# EAGLE schematic anemo2 (EAGLE 6.4)
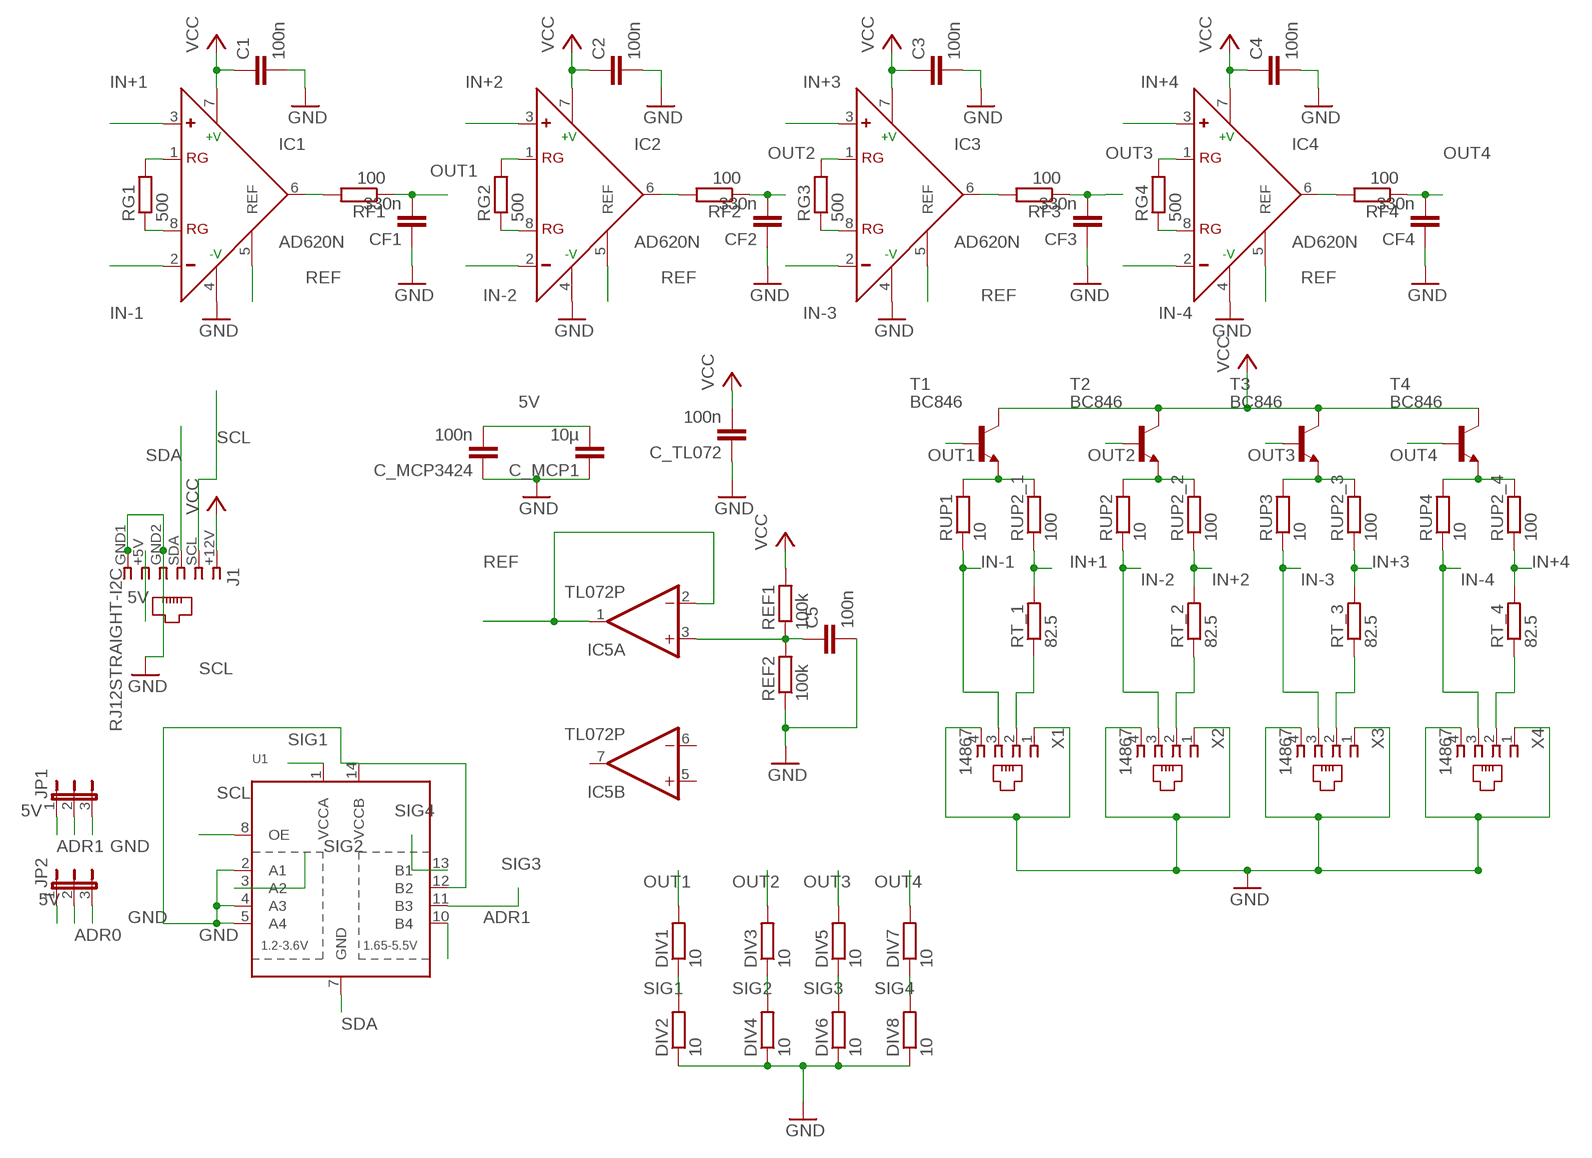
[diagram p0: schematic, sheet 1]

## Parts
C1  100n  C-EUC1206  [C1206]
C2  100n  C-EUC1206  [C1206]
C3  100n  C-EUC1206  [C1206]
C4  100n  C-EUC1206  [C1206]
C5  100n  C-EUC1206  [C1206]
C_MCP1  10µ  C-EUC1206  [C1206]
C_MCP3424  100n  C-EUC1206  [C1206]
C_TL072  100n  C-EUC1206  [C1206]
CF1  330n  C-EUC1206  [C1206]
CF2  330n  C-EUC1206  [C1206]
CF3  330n  C-EUC1206  [C1206]
CF4  330n  C-EUC1206  [C1206]
DIV1  10  R-EU_M1206  [M1206]
DIV2  10  R-EU_M1206  [M1206]
DIV3  10  R-EU_M1206  [M1206]
DIV4  10  R-EU_M1206  [M1206]
DIV5  10  R-EU_M1206  [M1206]
DIV6  10  R-EU_M1206  [M1206]
DIV7  10  R-EU_M1206  [M1206]
DIV8  10  R-EU_M1206  [M1206]
IC1  AD620N  [DIL08]
IC2  AD620N  [DIL08]
IC3  AD620N  [DIL08]
IC4  AD620N  [DIL08]
IC5  TL072P  [DIL08]
J1  RJ12STRAIGHT-I2C  [RJ12-STRAIGHT-I2C]
JP1  JP2E  [JP2]
JP2  JP2E  [JP2]
REF1  100k  R-EU_M1206  [M1206]
REF2  100k  R-EU_M1206  [M1206]
RF1  100  R-EU_M1206  [M1206]
RF2  100  R-EU_M1206  [M1206]
RF3  100  R-EU_M1206  [M1206]
RF4  100  R-EU_M1206  [M1206]
RG1  500  R-EU_M1206  [M1206]
RG2  500  R-EU_M1206  [M1206]
RG3  500  R-EU_M1206  [M1206]
RG4  500  R-EU_M1206  [M1206]
RT_1  82.5  R-EU_M1206  [M1206]
RT_2  82.5  R-EU_M1206  [M1206]
RT_3  82.5  R-EU_M1206  [M1206]
RT_4  82.5  R-EU_M1206  [M1206]
RUP1  10  R-EU_M1206  [M1206]
RUP2  10  R-EU_M1206  [M1206]
RUP2_1  100  R-EU_M1206  [M1206]
RUP2_2  100  R-EU_M1206  [M1206]
RUP2_3  100  R-EU_M1206  [M1206]
RUP2_4  100  R-EU_M1206  [M1206]
RUP3  10  R-EU_M1206  [M1206]
RUP4  10  R-EU_M1206  [M1206]
T1  BC846  [SOT23]
T2  BC846  [SOT23]
T3  BC846  [SOT23]
T4  BC846  [SOT23]
U1  TXB0104PWRSOIC14  [SO14]
X1  14867  [14867]
X2  14867  [14867]
X3  14867  [14867]
X4  14867  [14867]

## Nets
5V: C_MCP1.2 C_MCP3424.2 J1.+5V JP1.1 JP2.1
ADR0: JP2.2
ADR1: JP1.2 U1.10(B4)
GND: C1.2 C2.2 C3.2 C4.2 C5.2 C_MCP1.1 C_MCP3424.1 C_TL072.1 CF1.1 CF2.1 CF3.1 CF4.1 DIV2.1 DIV4.1 DIV6.1 DIV8.1 IC1.4(-V) IC2.4(-V) IC3.4(-V) IC4.4(-V) J1.GND1 J1.GND2 JP1.3 JP2.3 REF2.1 U1.2(A1) U1.4(A3) U1.5(A4) U1.12(B2) U1.14(VCCB) X1.1 X1.4 X2.1 X2.4 X3.1 X3.4 X4.1 X4.4
IN+1: IC1.3(+) RT_1.2 RUP2_1.1
IN+2: IC2.3(+) RT_2.2 RUP2_2.1
IN+3: IC3.3(+) RT_3.2 RUP2_3.1
IN+4: IC4.3(+) RT_4.2 RUP2_4.1
IN-1: IC1.2(-) RUP1.1 X1.3
IN-2: IC2.2(-) RUP2.1 X2.3
IN-3: IC3.2(-) RUP3.1 X3.3
IN-4: IC4.2(-) RUP4.1 X4.3
N$1: IC1.1(RG) RG1.2
N$2: IC1.8(RG) RG1.1
N$3: IC2.8(RG) RG2.1
N$4: IC2.1(RG) RG2.2
N$5: IC3.1(RG) RG3.2
N$6: IC3.8(RG) RG3.1
N$7: IC4.1(RG) RG4.2
N$8: IC4.8(RG) RG4.1
N$9: RUP1.2 RUP2_1.2 T1.2(E)
N$10: C5.1 IC5.3(A:+IN) REF1.1 REF2.2
N$11: RUP2.2 RUP2_2.2 T2.2(E)
N$12: RUP2_3.2 RUP3.2 T3.2(E)
N$13: RUP2_4.2 RUP4.2 T4.2(E)
N$18: IC1.6(OUT) RF1.2
N$19: IC2.6(OUT) RF2.2
N$20: IC3.6(OUT) RF3.2
N$21: IC4.6(OUT) RF4.2
N$23: RT_1.1 X1.2
N$25: RT_2.1 X2.2
N$27: RT_3.1 X3.2
N$29: RT_4.1 X4.2
OUT1: CF1.2 DIV1.2 RF1.1 T1.1(B)
OUT2: CF2.2 DIV3.2 RF2.1 T2.1(B)
OUT3: CF3.2 DIV5.2 RF3.1 T3.1(B)
OUT4: CF4.2 DIV7.2 RF4.1 T4.1(B)
REF: IC1.5(REF) IC2.5(REF) IC3.5(REF) IC4.5(REF) IC5.1(A:OUT) IC5.2(A:-IN)
SCL: J1.SCL U1.8(OE)
SDA: J1.SDA U1.7(GND)
SIG1: DIV1.1 DIV2.2 U1.1(VCCA)
SIG2: DIV3.1 DIV4.2 U1.3(A2)
SIG3: DIV5.1 DIV6.2 U1.11(B3)
SIG4: DIV7.1 DIV8.2 U1.13(B1)
VCC: C1.1 C2.1 C3.1 C4.1 C_TL072.2 IC1.7(+V) IC2.7(+V) IC3.7(+V) IC4.7(+V) J1.+12V REF1.2 T1.3(C) T2.3(C) T3.3(C) T4.3(C)
Unconnected: IC5.5(B:+IN) IC5.6(B:-IN) IC5.7(B:OUT)

## Power pins joined to a net without a drawn wire
V+: IC5.8(P:V+)
V-: IC5.4(P:V-)

## Library data of the parts
C1-C5 C_MCP1 C_MCP3424 C_TL072 CF1-CF4 = rcl:C-EU: CAPACITOR, European symbol
DIV1-DIV8 REF1 REF2 RF1-RF4 RG1-RG4 RT_1-RT_4 RUP1 RUP2 RUP2_1-RUP2_4 RUP3 RUP4 = resistor:R-EU_: RESISTOR, European symbol
IC1-IC4 = analog-devices:AD620: Low Cost, Low Power, Instrumentation Amplifier Source: http://www.analog.com/UploadedFiles/Data_Sheets/37793330023930AD620_e.pdf; MF: ALTERA CORPORATION; MPN: AD620AN; OC_FARNELL: 1523782; OC_NEWARK: 05F7108
IC5 = linear:TL072: OP AMP
J1 = lpatiny:RJ12: CORCOM Modular RJ Jacks No Shield Source: www.tycoelectronics.com .. ENG_DS_1654001_1099_RJ_L_0507.pdf
JP1 JP2 = jumper:JP2E: JUMPER
T1-T4 = transistor:BC846: NPN TRANSISTOR
U1 = SparkFun-DigitalIC:TXB0104PWR: 4-Bit Bi-Directional Level Shifter 1.2V-3.6V (VCCA) to 1.65V-5.5V (VCCB) bi-directional level shifter with auto direction sensing. Max data rate - VCCA 1.8V: 20Mbps (50ns), VCCA 3.3V: 100Mbps (10ns) Digikey: 296-21929-1-ND (TSSOP) IC-11329; PROD_ID: IC-11329
X1-X4 = con-4ucon:14867: RJ11 Connector Source: 4UCON TECHNOLOGY INC. 14867.pdf; OC_FARNELL: unknown; OC_NEWARK: unknown